# Altium schematic sheet 2-3P针座_2025-04-07.schdoc
size 41 x 32 mm
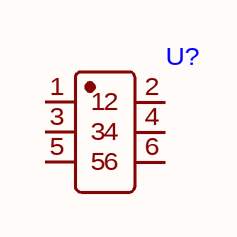
[diagram p0: 2-3P针座_2025-04-07.schdoc]

## Parts
U?  (no value)  [HDR-SMD_6P-P1.27-V-M-R2-C3-S1.27-LS5.5]

## Nets

Not connected (* = marked no-connect by the designer): U? 1 2 3 4 5 6

## Library data of the parts
U? = 2*3P针座